# Altium project LCC_Terminator.PrjPcb
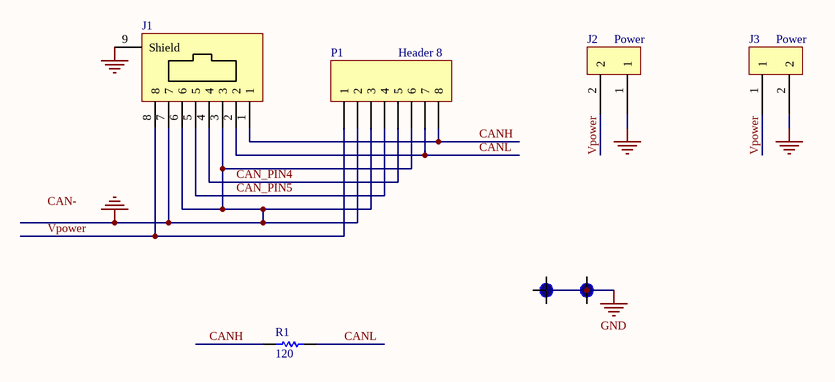
[diagram p0: LCC_Terminator.SchDoc]
1 sheet, 7 parts. Net scope: global (net labels, ports and power ports of the same name join across sheets).

## Sheet LCC_Terminator.SchDoc
size A4

### Parts
H3  Hole  [Mounting Hole M3]  (value not drawn)
H4  Hole  [Mounting Hole M3]  (value not drawn)
J1  RJ45 Amphenol RJHSE-5380  [Amphenol RJHSE-5380]  (value not drawn)
J2  Power  [0.156 SIP 2 PIN - R/A]
J3  Power  [DC 2.5mm PCB Jack]
P1  Header 8  [HDR1X8]
R1  value 120  [Resistor Axial 1/8W 0.4]  (hidden comment: Res1)

### Nets
GND: H3.1(GND) H4.1(GND) J1.3 J1.6 J1.7 J1.9(Shield) J2.1 J3.2 P1.2 P1.3 P1.6
CAN_PIN4: J1.4 P1.5
CAN_PIN5: J1.5 P1.4
CANH: J1.1 P1.8 R1.1
CANL: J1.2 P1.7 R1.2
Vpower: J1.8 J2.2 J3.1 P1.1

### Notes on the sheet
- Labels drawn without touching a wire or pin: CAN-

### Library data of the parts
H3 H4 = MountingHole
J1 = RJ45
J2 J3 = SIP2 CONNECTOR
P1 = Header 8: Header, 8-Pin; LatestRevisionDate: 17-Jul-2002; LatestRevisionNote: Re-released for DXP Platform.; Publisher: Altium Limited
R1 = Resistor